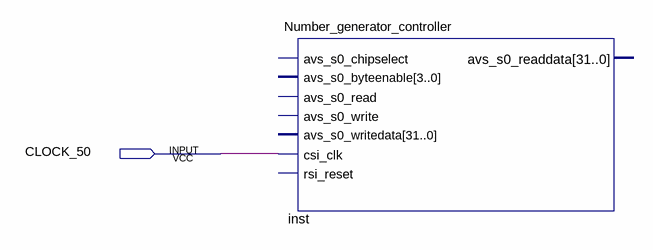
[diagram p0: schematic sheet]
// Quartus schematic NG_Controller_mult.bdf as structural Verilog: 1 symbols, 1 pins
module NG_Controller_mult (
  input  CLOCK_50
);

  Number_generator_controller inst (.csi_clk(CLOCK_50));  // open: avs_s0_chipselect, avs_s0_byteenable, avs_s0_read, avs_s0_write, avs_s0_writedata, rsi_reset, avs_s0_readdata
endmodule
